# EAGLE design logger_Chad (EAGLE 6.5.0)
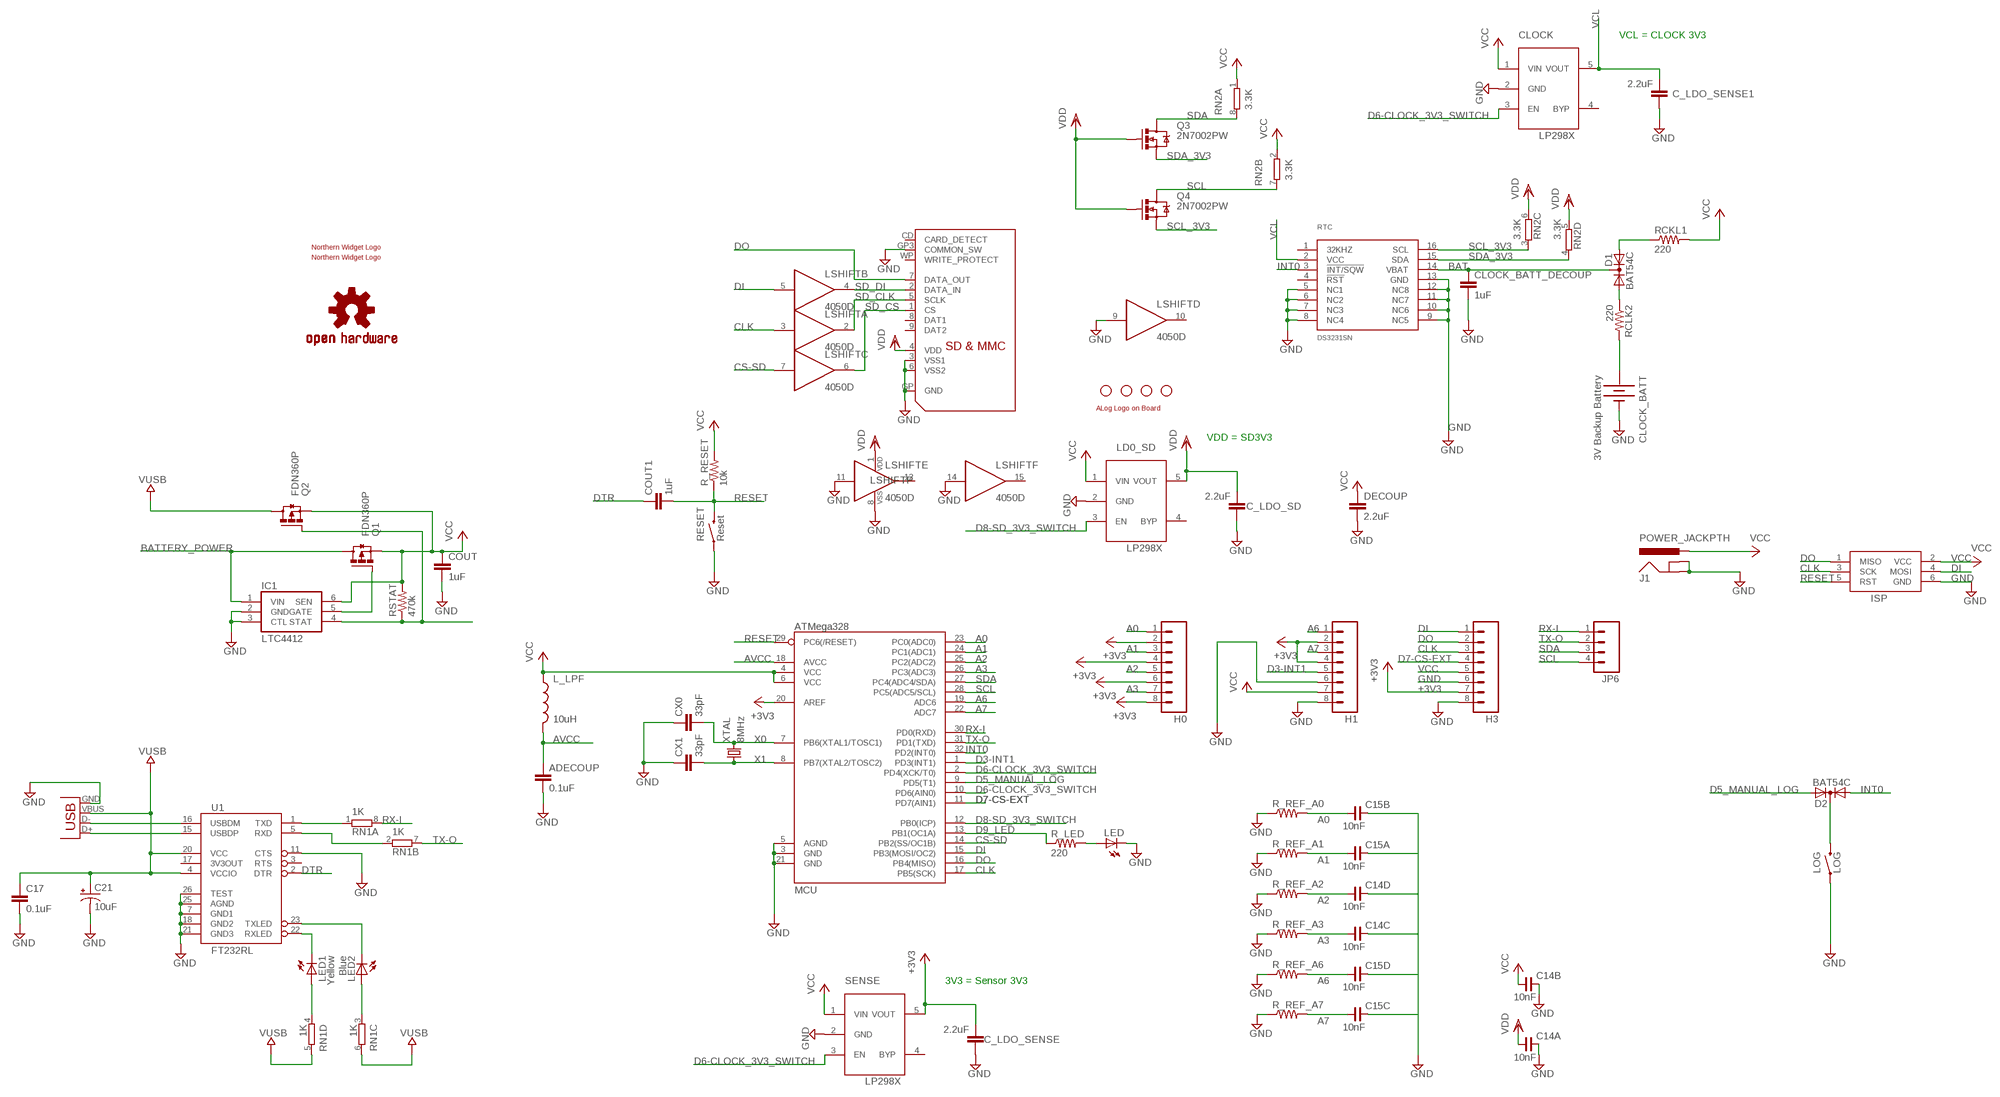
[diagram p0: schematic, sheet 1]

## Parts
ADECOUP  0.1uF  C-EUC0603  [C0603]
C14  10nF  CCA_ECJ-1206  [CECJ-1206]
C15  10nF  CCA_ECJ-1206  [CECJ-1206]
C17  0.1uF  C-EUC0603  [C0603]
C21  10uF  CAP_POL1206  [EIA3216]
C_LDO_SD  2.2uF  C-EUC0603  [C0603]
C_LDO_SENSE  2.2uF  C-EUC0603  [C0603]
C_LDO_SENSE1  2.2uF  C-EUC0603  [C0603]
CLOCK  LP2985  LP298XS  [SOT23-5L]
CLOCK_BATT  3V Backup Battery  BATTERY12PTH  [BATTCON_12MM_PTH]
CLOCK_BATT_DECOUP  1uF  C-EUC0603  [C0603]
COUT  1uF  C-EUC0603  [C0603]
COUT1  1uF  C-EUC0603  [C0603]
CX0  33pF  C-EUC0603  [C0603]
CX1  33pF  C-EUC0603  [C0603]
D1  BAT54C  DIODE_AC-CA_  [SOT23C]
D2  BAT54C  DIODE_AC-CA_  [SOT23C]
DECOUP  2.2uF  C-EUC0603  [C0603]
H0  M083.5MM-8  [SCREWTERMINAL-3.5MM-8]
H1  M083.5MM-8  [SCREWTERMINAL-3.5MM-8]
H3  M083.5MM-8  [SCREWTERMINAL-3.5MM-8]
IC1  LTC4412  LTC4412ES6  [TSOT23-6]
ISP  AVRISP-6  [AVRISP]
J1  POWER_JACKPTH  [POWER_JACK_PTH]
JP1  STAND-OFF  [STAND-OFF]
JP2  STAND-OFF  [STAND-OFF]
JP3  STAND-OFF  [STAND-OFF]
JP4  STAND-OFF  [STAND-OFF]
JP5  USB-B  USBPTH  [USB-B-PTH]
JP6  M04SCREW  [SCREWTERMINAL-3.5MM-4]
L_LPF  10uH  INDUCTOR0805  [0805]
LD0_SD  LP2985  LP298XS  [SOT23-5L]
LED  LED3MM  [LED3MM]
LED1  Yellow  LED0603  [LED-0603]
LED2  Blue  LED0603  [LED-0603]
LOG  LOG  SWITCH-MOMENTARY-2PTH  [TACTILE-PTH]
LOGO1  OSHW-LOGOM  [OSHW-LOGO-M]
LSHIFT  4050D  [SO16]
MCU  ATMega328  ATMEGA168  [TQFP32-08]
Q1  FDN360P  [SUPER-SOT3]
Q2  FDN360P  [SUPER-SOT3]
Q3  2N7002PW  MOSFET-NCHANNELSOT323  [SOT323]
Q4  2N7002PW  MOSFET-NCHANNELSOT323  [SOT323]
R_LED  220  R-US_R0603  [R0603]
R_REF_A0  R-US_0207/10  [0207/10]
R_REF_A1  R-US_0207/10  [0207/10]
R_REF_A2  R-US_0207/10  [0207/10]
R_REF_A3  R-US_0207/10  [0207/10]
R_REF_A6  R-US_0207/10  [0207/10]
R_REF_A7  R-US_0207/10  [0207/10]
R_RESET  10k  R-US_R0603  [R0603]
RCKL1  220  R-US_R0603  [R0603]
RCLK2  220  R-US_R0603  [R0603]
RESET  Reset  SWITCH-MOMENTARY-2PTH  [TACTILE-PTH]
RN1  1K  4R-N0603-ARC  [0603-ARC]
RN2  3.3K  4R-N0603-ARC  [0603-ARC]
RSTAT  470k  R-US_R0603  [R0603]
RTC  DS3231SN  [SO16W]
SD  SDMMC06132  [06132]
SENSE  LP2985  LP298XS  [SOT23-5L]
U1  FT232RL  FT232RL-BASICSSOP  [SSOP28DB]
U$1  NWLOGO  [NWLOGO]
U$2  ALOG_LOGO_V1_5.5MM  [ALOG_LOGO_V1_SMALL]
U$3  NWLOGO_MED  [NWLOGO_MED]
XTAL  8MHz  CRYSTALHC49UV  [HC49U-V]

## Nets
+3V3: C_LDO_SENSE.2 H0.2 H0.4 H0.6 H0.8 H1.2 H1.4 H3.7 MCU.20(AREF) SENSE.5(VOUT)
A0: C15.B1 H0.1 MCU.23(PC0(ADC0)) R_REF_A0.2
A1: C15.A1 H0.3 MCU.24(PC1(ADC1)) R_REF_A1.2
A2: C14.D1 H0.5 MCU.25(PC2(ADC2)) R_REF_A2.2
A3: C14.C1 H0.7 MCU.26(PC3(ADC3)) R_REF_A3.2
A6: C15.D1 H1.1 MCU.19(ADC6) R_REF_A6.2
A7: C15.C1 H1.3 MCU.22(ADC7) R_REF_A7.2
AVCC: ADECOUP.1 L_LPF.2 MCU.18(AVCC)
BAT: CLOCK_BATT_DECOUP.1 D1.3(K) RTC.14(VBAT)
BATTERY_POWER: IC1.1(VIN) Q1.3(D)
CLK: H3.3 ISP.3(SCK) LSHIFT.3(A:I) MCU.17(PB5(SCK))
CS-SD: LSHIFT.7(C:I) MCU.14(PB2(SS/OC1B))
D3-INT1: H1.5 MCU.1(PD3(INT1))
D5_MANUAL_LOG: D2.2(A2) MCU.9(PD5(T1))
D6-CLOCK_3V3_SWITCH: CLOCK.3(EN) MCU.2(PD4(XCK/T0)) MCU.10(PD6(AIN0)) SENSE.3(EN)
D7-CS-EXT: H3.4 MCU.11(PD7(AIN1))
D8-SD_3V3_SWITCH: LD0_SD.3(EN) MCU.12(PB0(ICP))
D9_LED: MCU.13(PB1(OC1A)) R_LED.1
DI: H3.1 ISP.4(MOSI) LSHIFT.5(B:I) MCU.15(PB3(MOSI/OC2))
DO: H3.2 ISP.1(MISO) MCU.16(PB4(MISO)) SD.7(DATA_OUT)
DTR: COUT1.1 U1.2(DTR)
GND: ADECOUP.2 C14.A2 C14.B2 C14.C2 C14.D2 C15.A2 C15.B2 C15.C2 C15.D2 C17.2 C21.C(-) C_LDO_SD.1 C_LDO_SENSE1.1 C_LDO_SENSE.1 CLOCK.2(GND) CLOCK_BATT.GND(-) CLOCK_BATT_DECOUP.2 COUT.2 CX0.1 CX1.1 DECOUP.2 H1.6 H1.8 H3.6 H3.8 IC1.2(GND) IC1.3(CTL) ISP.6(GND) J1.GND J1.GNDBREAK JP5.GND LD0_SD.2(GND) LED.K(C) LOG.1 LSHIFT.8(P:VSS) LSHIFT.9(D:I) LSHIFT.11(E:I) LSHIFT.14(F:I) MCU.3(GND) MCU.5(AGND) MCU.21(GND) R_REF_A0.1 R_REF_A1.1 R_REF_A2.1 R_REF_A3.1 R_REF_A6.1 R_REF_A7.1 RESET.1 RTC.5(NC1) RTC.6(NC2) RTC.7(NC3) RTC.8(NC4) RTC.9(NC5) RTC.10(NC6) RTC.11(NC7) RTC.12(NC8) RTC.13(GND) SD.3(VSS1) SD.6(VSS2) SD.GP3(COMMON_SW) SD.GP(GND) SENSE.2(GND) U1.7(GND1) U1.11(CTS) U1.18(GND2) U1.21(GND3) U1.25(AGND) U1.26(TEST)
INT0: D2.1(A1) MCU.32(PD2(INT0)) RTC.3(!INT/SQW)
LED+: LED.A R_LED.2
N$1: D1.1(A1) RCLK2.1
N$2: CLOCK_BATT.VCC@1(+) RCLK2.2
N$3: JP5.D+ U1.15(USBDP)
N$4: JP5.D- U1.16(USBDM)
N$5: LED1.C U1.22(RXLED)
N$6: LED2.C U1.23(TXLED)
N$7: IC1.4(STAT) Q2.1(G) RSTAT.1
N$8: IC1.5(GATE) Q1.1(G)
N$9: LED1.A RN1.4
N$10: LED2.A RN1.3
N$11: D2.3(K) LOG.3
N$27: RN1.1 U1.1(TXD)
N$29: RN1.2 U1.5(RXD)
N$67: D1.2(A2) RCKL1.1
RESET: COUT1.2 ISP.5(RST) MCU.29(PC6(/RESET)) R_RESET.1 RESET.3
RX-I: JP6.1 MCU.30(PD0(RXD)) RN1.8
SCL: JP6.4 MCU.28(PC5(ADC5/SCL)) Q4.3(D) RN2.7
SCL_3V3: Q4.2(S) RN2.3 RTC.16(SCL)
SD_CLK: LSHIFT.2(A:O) SD.5(SCLK)
SD_CS: LSHIFT.6(C:O) SD.1(CS)
SD_DI: LSHIFT.4(B:O) SD.2(DATA_IN)
SDA: JP6.3 MCU.27(PC4(ADC4/SDA)) Q3.3(D) RN2.8
SDA_3V3: Q3.2(S) RN2.4 RTC.15(SDA)
TX-O: JP6.2 MCU.31(PD1(TXD)) RN1.7
VCC: C14.B1 CLOCK.1(VIN) COUT.1 DECOUP.1 H1.7 H3.5 IC1.6(SEN) ISP.2(VCC) J1.PWR L_LPF.1 LD0_SD.1(VIN) MCU.4(VCC) MCU.6(VCC) Q1.2(S) Q2.2(S) R_RESET.2 RCKL1.2 RN2.1 RN2.2 RSTAT.2 SENSE.1(VIN)
VCL: C_LDO_SENSE1.2 CLOCK.5(VOUT) RTC.2(VCC)
VDD: C14.A1 C_LDO_SD.2 LD0_SD.5(VOUT) LSHIFT.1(P:VDD) Q3.1(G) Q4.1(G) RN2.5 RN2.6 SD.4(VDD)
VUSB: C17.1 C21.A(+) JP5.VBUS Q2.3(D) RN1.5 RN1.6 U1.4(VCCIO) U1.20(VCC)
X0: CX0.2 MCU.7(PB6(XTAL1/TOSC1)) XTAL.2
X1: CX1.2 MCU.8(PB7(XTAL2/TOSC2)) XTAL.1
Unconnected: CLOCK.4(BYP) LD0_SD.4(BYP) LSHIFT.10(D:O) LSHIFT.12(E:O) LSHIFT.15(F:O) RTC.1(32KHZ) RTC.4(!RST) SD.8(DAT1) SD.9(DAT2) SD.CD(CARD_DETECT) SD.WP(WRITE_PROTECT) SENSE.4(BYP) U1.3(RTS) U1.17(3V3OUT)

## Notes on the sheet
- VCL = CLOCK 3V3
- VDD = SD3V3
- 3V3 = Sensor 3V3

## Library data of the parts
ADECOUP C17 C_LDO_SD C_LDO_SENSE C_LDO_SENSE1 CX0 CX1 DECOUP = resistor:C-EU: CAPACITOR, European symbol
C14 C15 = rc-master-smd:CCA_: CHIP CAP ARRAY
C21 = SparkFun-Passives:CAP_POL: Capacitor Polarized These are standard SMD and PTH capacitors. Normally 10uF, 47uF, and 100uF in electrolytic and tantalum varieties. Always verify the external diameter of the through hole cap, it varies with capacity, voltage, and manufacturer. The EIA devices should be standard.
CLOCK LD0_SD SENSE = adafruit:LP298X
CLOCK_BATT = SparkFun:BATTERY: Battery Holders Various common sizes : AA, AAA, 20mm coin cell and 12mm coin cell.
CLOCK_BATT_DECOUP COUT COUT1 = rcl:C-EU: CAPACITOR, European symbol
D1 D2 = semicon-smd-ipc:DIODE_AC-CA_: DUAL DIODE
H0 H1 H3 = SparkFun:M08: Header 8 Standard 8-pin 0.1" header. Use with straight break away headers (SKU : PRT-00116), right angle break away headers (PRT-00553), swiss pins (PRT-00743), machine pins (PRT-00117), and female headers (PRT-00115).
IC1 = awickert:LTC4412*: Low Loss PowerPath Controller
ISP = adafruit:AVRISP: AVR ISP HEADER Standard 6 pin header for AVR programming
J1 = SparkFun:POWER_JACK: Power Jack This is the standard 5.5mm barrel jack for power. The PTH is the most common, proven, reliable, footprint. All others are experimental. The Slot footprint only works if the mill layer is transmitted to the PCB fab house so be warned. Spark Fun Electronics SKU : PRT-00119. Mating wall wart : TOL-00298 (and others)
JP1-JP4 = SparkFun:STAND-OFF: Stand Off This is the mechanical footprint for a #4 phillips button head screw. Use the keepout ring to avoid running the screw head into surrounding components. SKU : PRT-00447
JP5 = SparkFun-Connectors:USB: USB Connectors USB-B-PTH is fully proven SKU : PRT-00139/CONN-08278 USB-miniB is fully proven SKU : PRT-00587 USB-A-PCB is untested. USB-A-H is throughly reviewed, but untested. Spark Fun Electronics SKU : PRT-00437 USB-B-SMT is throughly reviewed, but untested. Needs silkscreen touching up. USB-A-S has not been used/tested USB-MB-H has not been used/tested USB-MICROB has been used. CONN-09505; PROD_ID: CONN-08278
JP6 = SparkFun-Connectors:M04: Header 4 Standard 4-pin 0.1" header. Use with straight break away headers (SKU : PRT-00116), right angle break away headers (PRT-00553), swiss pins (PRT-00743), machine pins (PRT-00117), and female headers (PRT-00115). Molex polarized connector foot print use with SKU : PRT-08231 with associated crimp pins and housings. 1MM SMD Version SKU: PRT-10208; PROD_ID: Combine 2x8399
L_LPF = SparkFun:INDUCTOR: Inductors Basic Inductor/Choke - 0603 and 1206. Footprints are not proven and vary greatly between part numbers.
LED = SparkFun:LED: LEDs Standard schematic elements and footprints for 5mm, 3mm, 1206, and 0603 sized LEDs. 5mm - Spark Fun Electronics SKU : COM-00529 (and others)
LED1 LED2 = SparkFun-LED:LED: LEDs Standard schematic elements and footprints for 5mm, 3mm, 1206, and 0603 sized LEDs. 5mm - Spark Fun Electronics SKU : COM-00529 (and others)
LOG RESET = SparkFun-Electromechanical:SWITCH-MOMENTARY-2: Various NO switches- pushbuttons, reed, etc; PROD_ID: SWCH-08441
LOGO1 = SparkFun-Aesthetics:OSHW-LOGO: Open Source Hardware Logo This logo indicates the piece of hardware it is found on incorporates a OSHW license and/or adheres to the definition of open source hardware found here: http://freedomdefined.org/OSHW
LSHIFT = 40xx:4050: Hex non-inverting BUFFER
MCU = SparkFun:ATMEGA168
Q1 Q2 = transistor-power:FDN360P: Single P-Channel, PowerTrench (R) MOSFET Source: http://www.fairchildsemi.com/ds/FD/FDN360P.pdf
Q3 Q4 = SparkFun-DiscreteSemi:MOSFET-NCHANNEL: Generic NMOS footprint
R_LED R_REF_A0 R_REF_A1-R_REF_A3 R_REF_A6 R_REF_A7 = resistor:R-US_: RESISTOR, American symbol
R_RESET RCKL1 RCLK2 RSTAT = rcl:R-US_: RESISTOR, American symbol
RN1 RN2 = resistor-dil:4R-N: Array Chip Resistor Source: RS Component / Phycomp; OC_FARNELL: unknown; OC_NEWARK: unknown
RTC = comfile:DS3231SN
SD = adafruit:SDMMC: SD MMC Card holder 4UCON part #06132 - easy to solder
U1 = SparkFun-DigitalIC:FT232RL-BASIC: USB UART This is the simplified version of the FT232RL unit. Only what you need, nothing you don't. Spark Fun Electronics SKU : COM-00650
U$1 = awickert:NWLOGO
U$2 = awickert:ALOG_LOGO_V1_5.5MM
U$3 = awickert:NWLOGO_MED: Medium-sized Northern Widget logo
XTAL = SparkFun:CRYSTAL: Crystals Various standard crystals. Proven footprints. Spark Fun Electronics SKU : COM-00534

## Net classes
0 default: width 0.203 mm, drill 0.305 mm
1 power: width 0.305 mm, drill 0.508 mm
2 gnd: width 0.61 mm, drill 0.508 mm, clearance 0.203 mm
3 usbvcc: width 0.508 mm, drill 0.508 mm, clearance 0.152 mm
4 aref: width 0.406 mm

## Board
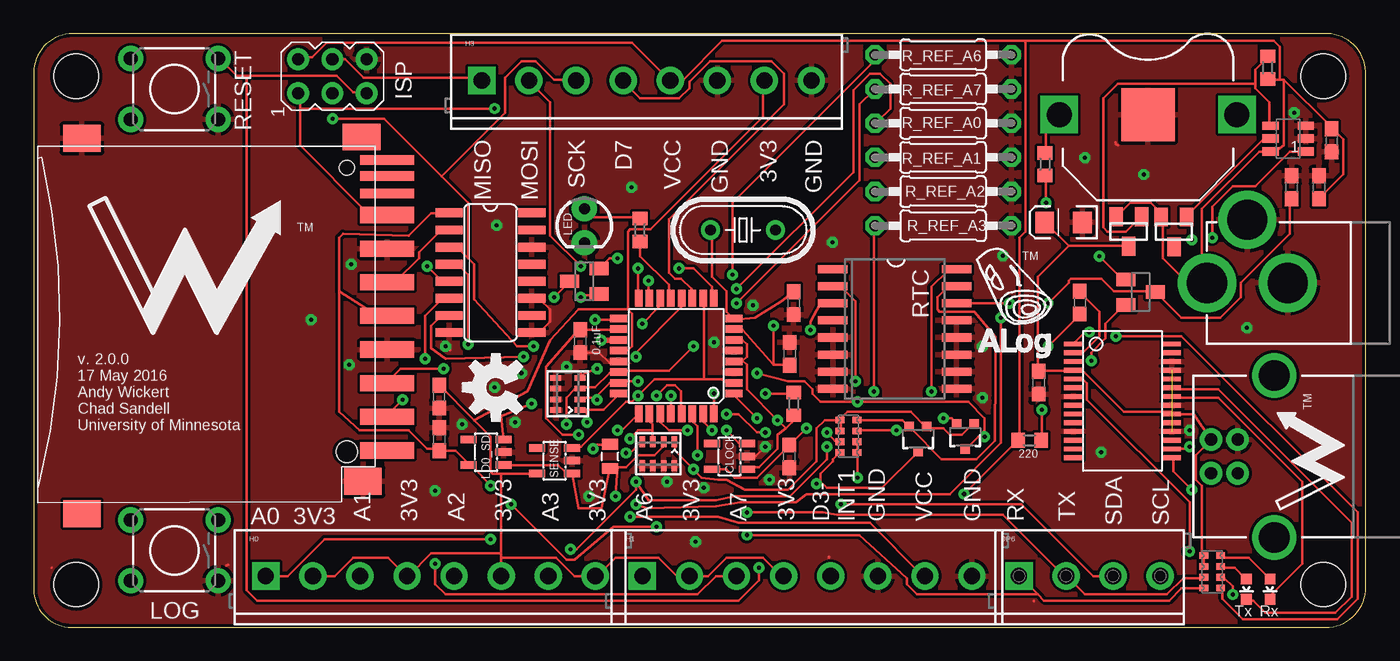
[diagram p1: board, top side]
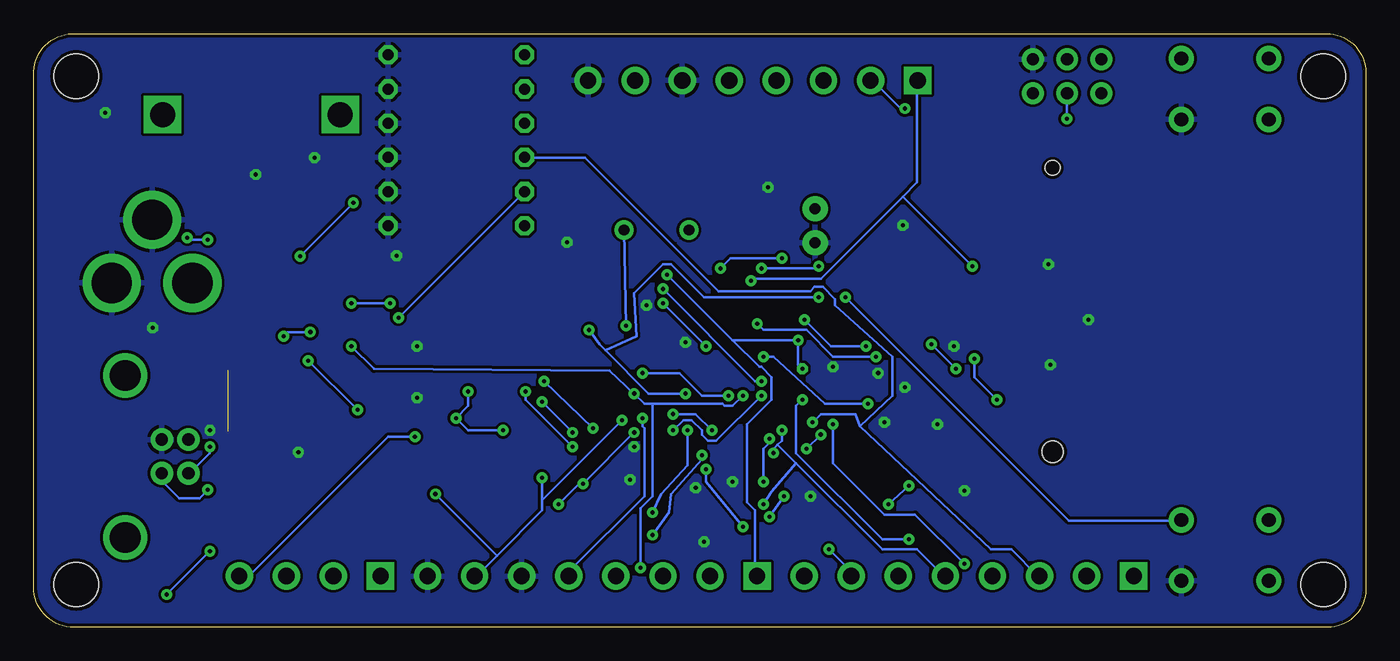
[diagram p2: board, bottom side, seen from below]

Size 99.05 x 44.12 mm. Coordinates in mm from the lower left corner, seen from the top.
Outline: 99.05,41.32 arc90 95.93,44.12 2.91,44.12 arc90 0,41.21 0,2.85 arc90 2.85,0 96.06,0 arc90 99.05,2.98 99.05,41.32
Copper layers (1*16): Top 0.035mm / dielectric 1.5mm / Bottom 0.035mm
Design rules "SparkFun *": minimum track width 8mil, minimum drill 12mil, track to track 8mil, track to pad 8mil, pad to pad 8mil, via to via 8mil, smd to smd 8mil, copper to edge 10mil, drill to drill 8mil, minimum pad ring 12mil, minimum via ring 10mil, stop-mask expansion 4mil, vias tented up to drill 25mil, thermal gap 10mil

### Footprints (pad centres in the part's own frame; a part is rotated, then mirrored left to right if it is on the bottom)
C0603 = smd 1.1 x 1: 1 -0.85,0; 2 0.85,0
CECJ-1206 = smd 0.406 x 0.813: A1 -1.2,-0.9; A2 -1.2,0.9; B1 -0.4,-0.9; B2 -0.4,0.9; C1 0.4,-0.9; C2 0.4,0.9; D1 1.2,-0.9; D2 1.2,0.9
EIA3216 = smd 1.4 x 1.6: A 1.4,0; C -1.4,0
SOT23-5L = smd 0.55 x 1.2: 1 -0.95,-1.3; 2 0,-1.3; 3 0.95,-1.3; 4 0.95,1.3; 5 -0.95,1.3
BATTCON_12MM_PTH = smd 3.962 x 3.962: GND 0,0 | drill 1.854 square: VCC@1 -6.604,0; VCC@2 6.604,0
SOT23C = smd 1 x 1.4: 1 -0.95,-1.1; 2 0.95,-1.1; 3 0,1.1
SCREWTERMINAL-3.5MM-8 = drill 1.2 pad 2.032 square: 1 0,0 | drill 1.2 pad 2.032: 2 3.5,0; 3 7,0; 4 10.5,0; 5 14,0; 6 17.5,0; 7 21,0; 8 24.5,0
TSOT23-6 = smd 0.622 x 1.22: 1 -0.95,-1.31; 2 0,-1.31; 3 0.95,-1.31; 4 0.95,1.31; 5 0,1.31; 6 -0.95,1.31
AVRISP = drill 0.9 pad 1.626: 1 -1.27,2.54; 2 1.27,2.54; 3 -1.27,0; 4 1.27,0; 5 -1.27,-2.54; 6 1.27,-2.54
POWER_JACK_PTH = drill 2.997 pad 4.318: GND 0,7.7; GNDBREAK 4.7,10.7; PWR 0,13.7
STAND-OFF = hole 3.302: 0,0
USB-B-PTH = drill 0.914 pad 1.676: D+ 0,1.25; D- 1.981,1.25; GND 0,-1.25; VBUS 1.981,-1.25 | drill 2.286: S1 -2.718,-6.02; S2 -2.718,6.02
SCREWTERMINAL-3.5MM-4 = drill 1.2 pad 2.032 square: 1 0,0 | drill 1.2 pad 2.032: 2 3.5,0; 3 7,0; 4 10.5,0
0805 = smd 0.8 x 1.2: 1 -0.9,0; 2 0.9,0
LED3MM = drill 0.813 pad 1.88: A -1.27,0; K 1.27,0
LED-0603 = smd 0.8 x 0.8: A 0,-0.75; C 0,0.75
TACTILE-PTH = drill 1.016 pad 1.88: 1 -3.251,2.261; 2 3.251,2.261; 3 -3.251,-2.261; 4 3.251,-2.261
SO16 = smd 0.66 x 2.032: 1 -4.445,-3.073; 2 -3.175,-3.073; 3 -1.905,-3.073; 4 -0.635,-3.073; 5 0.635,-3.073; 6 1.905,-3.073; 7 3.175,-3.073; 8 4.445,-3.073; 9 4.445,3.073; 10 3.175,3.073; 11 1.905,3.073; 12 0.635,3.073; 13 -0.635,3.073; 14 -1.905,3.073; 15 -3.175,3.073; 16 -4.445,3.073
TQFP32-08 = smd 1.27 x 0.559: 1 -4.293,2.8; 2 -4.293,2; 3 -4.293,1.2; 4 -4.293,0.4; 5 -4.293,-0.4; 6 -4.293,-1.2; 7 -4.293,-2; 8 -4.293,-2.8; 17 4.293,-2.8; 18 4.293,-2; 19 4.293,-1.2; 20 4.293,-0.4; 21 4.293,0.4; 22 4.293,1.2; 23 4.293,2; 24 4.293,2.8 | smd 0.559 x 1.27: 9 -2.8,-4.293; 10 -2,-4.293; 11 -1.2,-4.293; 12 -0.4,-4.293; 13 0.4,-4.293; 14 1.2,-4.293; 15 2,-4.293; 16 2.8,-4.293; 25 2.8,4.293; 26 2,4.293; 27 1.2,4.293; 28 0.4,4.293; 29 -0.4,4.293; 30 -1.2,4.293; 31 -2,4.293; 32 -2.8,4.293
SUPER-SOT3 = smd 1 x 1.4: 1 -0.95,-1.1; 2 0.95,-1.1; 3 0,1.1
SOT323 = smd 0.7 x 0.7: 1 -0.65,-0.925; 2 0.65,-0.925; 3 0,0.925
R0603 = smd 1 x 1.1: 1 -0.85,0; 2 0.85,0
0207/10 = drill 0.813 octagon: 1 -5.08,0; 2 5.08,0
0603-ARC = smd 0.5 x 0.65: 1 -1.2,-0.625; 2 -0.4,-0.625; 3 0.4,-0.625; 4 1.2,-0.625; 5 1.2,0.625; 6 0.4,0.625; 7 -0.4,0.625; 8 -1.2,0.625
SO16W = smd 0.6 x 2.2: 1 -4.445,-4.6; 2 -3.175,-4.6; 3 -1.905,-4.6; 4 -0.635,-4.6; 5 0.635,-4.6; 6 1.905,-4.6; 7 3.175,-4.6; 8 4.445,-4.6; 9 4.445,4.6; 10 3.175,4.6; 11 1.905,4.6; 12 0.635,4.6; 13 -0.635,4.6; 14 -1.905,4.6; 15 -3.175,4.6; 16 -4.445,4.6
06132 = smd 1.2 x 4: 1 6.9,0.9; 2 4.4,0.9; 3 1.9,0.9; 4 -0.6,0.9; 5 -3.1,0.9; 6 -5.6,0.9; 7 -8.1,0.9; 9 9.4,0.9 | smd 0.7 x 4: 8 -9.7,0.9; CD -11,0.9; WP -12.2,0.9 | smd 2 x 2.8: GP -13.8,-21.8; GP2 14.1,-21.8; GP3 11.7,-0.9; GP4 -13.9,-1 | hole 1.1: -11.6,-2.1 | hole 1.6: 9.5,-2.1
SSOP28DB = smd 0.348 x 1.397: 1 -4.225,-3.656; 2 -3.575,-3.656; 3 -2.925,-3.656; 4 -2.275,-3.656; 5 -1.625,-3.656; 6 -0.975,-3.656; 7 -0.325,-3.656; 8 0.325,-3.656; 9 0.975,-3.656; 10 1.625,-3.656; 11 2.275,-3.656; 12 2.925,-3.656; 13 3.575,-3.656; 14 4.225,-3.656; 15 4.225,3.656; 16 3.575,3.656; 17 2.925,3.656; 18 2.275,3.656; 19 1.625,3.656; 20 0.975,3.656; 21 0.325,3.656; 22 -0.325,3.656; 23 -0.975,3.656; 24 -1.625,3.656; 25 -2.275,3.656; 26 -2.925,3.656; 27 -3.575,3.656; 28 -4.225,3.656
HC49U-V = drill 0.813: 1 -2.413,0; 2 2.413,0

### Placement (x,y rotation side)
ADECOUP  40.63,21.27 270 top
C14  46.45,12.9 180 top
C15  39.71,17.35 90 top
C17  74.72,18.19 270 top
C21  76.56,30.1 180 top
C_LDO_SD  30.15,13.97 270 top
C_LDO_SENSE  30.15,17.14 90 top
C_LDO_SENSE1  56.19,12.7 90 top
CLOCK  51.74,12.7 90 top
CLOCK_BATT  82.86,38.1 0 top
CLOCK_BATT_DECOUP  93.53,32.7 90 top
COUT  95.56,32.7 90 top
COUT1  77.78,24.13 270 top
CX0  56.2,20.32 270 top
CX1  56.51,24.09 90 top
D1  82.3,24.91 270 top
D2  40.95,25.72 90 top
DECOUP  96.51,36.2 270 top
H0  17.26,3.81 0 top
H1  45.26,3.81 0 top
H3  33.33,40.64 0 top
IC1  93.27,36.33 90 top
ISP  22.21,40.96 90 top
J1  100.94,25.59 90 top
JP1  3.17,3.17 0 top
JP2  95.88,40.96 90 top
JP3  95.88,3.17 90 top
JP4  3.17,40.96 0 top
JP5  89.52,12.7 180 top
JP6  73.26,3.81 0 top
L_LPF  42.85,12.7 90 top
LD0_SD  33.65,13.02 90 top
LED  40.95,29.84 270 top
LED1  91.92,2.83 180 top
LED2  90.17,2.83 180 top
LOG  10.47,5.71 180 top
LOGO1  34.37,17.83 90 top
LSHIFT  33.96,26.35 270 top
MCU  47.78,20.17 180 top
Q1  84.77,29.39 180 top
Q2  81.41,29.42 180 top
Q3  65.76,14.01 180 top
Q4  69.27,14.17 180 top
R_LED  45.08,29.53 90 top
R_REF_A0  67.62,37.47 180 top
R_REF_A1  67.62,34.92 180 top
R_REF_A2  67.62,32.38 180 top
R_REF_A3  67.62,29.84 180 top
R_REF_A6  67.62,42.55 180 top
R_REF_A7  67.62,40.01 180 top
R_RESET  56.51,16.61 270 top
RCKL1  74.04,13.89 180 top
RCLK2  75.19,34.42 90 top
RESET  10.47,40.01 180 top
RN1  87.62,4.13 90 top
RN2  60.58,14.2 90 top
RSTAT  91.75,41.59 270 top
RTC  64.02,22.17 270 top
SD  25.39,22.54 270 top
SENSE  38.73,12.38 90 top
U1  80.95,16.83 270 top
U$1  11.2,26.47 0 top
U$2  72.98,25.26 0 top
U$3  94.48,12.32 90 top
XTAL  52.75,29.53 0 top

### Tracks (layer width: path | path; a pad name or v marks a point on that pad's centre or on a via)
+3V3
  Top 0.203: H1.4 55.62,3.81 54.24,5.18 51.5,5.18 50.13,3.81 H1.2 47.84,3.81 46.47,5.18 43.27,5.18 41.9,3.81 H0.8 40.22,3.81 38.85,5.18 34.74,5.18 | H0.2 22.39,3.81 23.76,5.18 26.35,5.18 27.73,3.81 H0.4 27.88,3.81 29.56,5.49 34.74,5.49 | 32.76,15.39 33.98,14.17 33.98,11.58 34.13,11.43 34.74,11.43 | 32.76,15.39 30.16,17.98 C_LDO_SENSE.2 | 34.74,11.43 37.33,11.43 SENSE.5 | 44.19,23.62 44.49,23.32 44.49,20.88 44.19,20.57 43.58,20.57 MCU.20 | 44.19,23.62 40.53,23.62 38.4,21.34 36.72,17.53 32.76,15.39 | 34.74,11.43 34.74,5.49 | 34.74,5.49 34.74,5.18 | 34.74,5.18 34.74,3.81 H0.6 | 44.19,23.62 44.19,29.41 44.34,29.57 45.86,29.57 54.24,37.95 54.24,40.54 H3.7
A0  (via drill 0.3)
  Top 0.203: 41.75,17.07 40.68,17.07 C15.B1 | 41.75,17.07 42.81,18.14 43.42,18.14 MCU.23 43.58,18.29 v44.95,18.29 | v52.26,25.15 60.95,33.83 60.95,39.93 62.17,41.15 62.93,41.15 63.69,40.39 63.69,38.56 62.63,37.49 R_REF_A0.2 | H0.1 18.89,3.81 21.63,6.55 v33.98,6.55 | 41.75,17.07 v41.9,16.92
  Bottom 0.203: v44.95,18.29 45.41,18.29 v52.26,25.15 | v33.98,6.55 35.96,6.55 42.36,12.95 42.36,16.46 v41.9,16.92
A1  (via drill 0.3)
  Top 0.203: 41.14,16.15 42.36,16.15 43.42,17.22 MCU.24 | 41.14,16.15 40.68,16.15 C15.A1 | v41.14,15.24 41.14,16.15
  Bottom 0.203: v41.14,15.24 40.53,15.85 37.94,15.85 37.63,14.94 | 37.63,14.94 27.88,5.79 26.35,5.79 24.37,3.81 H0.3 | 37.63,14.94 35.19,17.22 35.19,20.12 39.46,23.93 39.46,24.38 40.38,25.3 40.99,25.3 41.29,24.99 48.15,24.99 58.05,34.9 62.47,34.9 R_REF_A1.2
A2  (via drill 0.3)
  Top 0.203: v44.03,12.95 44.34,12.95 45.1,13.72 C14.D1 | v43.42,14.63 43.73,14.63 44.95,15.85 MCU.25 | v71.92,23.01 71.92,13.72 68.11,9.91 57.45,9.91 56.68,9.3 52.57,9.3 50.74,8.99 45.56,8.84 v44.8,9.14
  Bottom 0.203: v44.03,12.95 44.03,13.26 43.73,13.56 | 43.73,13.56 43.42,13.87 v43.42,14.63 | 42.36,12.19 35.96,5.79 33.37,5.79 31.38,3.81 H0.5 | 42.36,12.19 43.73,13.56 | v71.92,23.01 62.63,32.31 R_REF_A2.2 | v44.8,9.14 44.19,10.06 42.36,12.19
A3  (via drill 0.3)
  Top 0.203: 46.02,14.63 46.02,15.09 45.86,15.24 45.86,15.85 MCU.26 | 46.02,14.63 46.02,13.87 C14.C1 | 46.02,14.63 44.95,14.63 v44.34,14.02 | v39.92,5.79 40.38,5.79 44.8,10.21 v44.8,10.82 45.71,9.45 50.74,9.45 52.11,9.75 56.23,9.75 58.97,12.5 v58.97,13.41 | v62.47,17.53 62.47,29.72 R_REF_A3.2
  Bottom 0.203: v44.34,14.02 44.34,13.72 44.8,13.26 v44.8,10.82 | v39.92,5.79 38.4,4.27 38.4,3.81 H0.7 | v62.47,17.53 62.47,16.92 v58.97,13.41
A6  (via drill 0.3)
  Top 0.203: 40.68,18.9 40.68,18.59 C15.D1 40.97,18.9 v41.9,19.2 | 42.81,21.34 43.42,21.34 MCU.19 | v51.96,26.21 51.96,31.55 62.47,42.06 62.47,42.52 R_REF_A6.2
  Top 0.406: v42.21,21.34 42.81,21.34
  Bottom 0.203: 47.08,21.34 v51.96,26.21 | 47.08,21.34 v42.21,21.34 42.21,19.51 v41.9,19.2 | 47.08,21.34 45.1,19.36 44.95,19.36 44.19,18.59 44.19,16.92 46.02,15.09 46.02,9.3 45.41,8.69 45.41,3.81 H1.1
A7  (via drill 0.3)
  Top 0.203: v49.06,20.88 47.23,19.05 43.58,19.05 MCU.22 43.42,18.9 42.81,18.9 41.75,17.83 40.68,17.83 C15.C1 40.53,17.68 40.22,17.68 39.61,17.07 v39.61,15.09 | v52.26,24.08 61.41,33.22 61.41,38.86 62.47,39.93 R_REF_A7.2 | H1.3 50.74,3.81 49.37,2.44 30.62,2.44 29.86,3.2 v29.86,4.72
  Bottom 0.203: v52.26,24.08 v49.06,20.88 | v29.86,4.72 33.52,8.38 35.8,8.38 39.61,12.19 v39.61,15.09
AVCC  (via drill 0.3)
  Top 0.203: MCU.18 43.42,22.1 40.68,22.1 ADECOUP.1 40.53,22.1 38.09,19.36 38.09,15.54 39.31,14.33 v40.53,14.33 | v41.59,13.26 41.9,13.56 42.81,13.56 L_LPF.2
  Bottom 0.203: v40.53,14.33 v41.59,13.26
BAT  (via drill 0.3)
  Top 0.203: CLOCK_BATT_DECOUP.1 93.41,31.85 93.41,29.26 89.75,25.6 89.75,24.54 88.23,23.01 85.33,23.01 83.5,24.84 D1.3 83.35,24.99 80.3,24.99 79.39,25.91 77.1,25.91 76.95,25.76 76.95,25.6 v75.43,24.08 | v72.53,24.08 RTC.14
  Bottom 0.203: v75.43,24.08 v72.53,24.08
BATTERY_POWER  (via drill 0.3)
  Top 0.203: v87.62,28.96 87.62,31.24 89.14,32.77 90.82,32.77 93.41,35.36 94.48,35.36 IC1.1 | v86.1,28.8 85.33,28.8 84.88,28.35 Q1.3
  Bottom 0.203: v87.62,28.96 87.47,28.8 v86.1,28.8
CLK  (via drill 0.3)
  Top 0.203: v41.75,22.86 43.42,22.86 MCU.17 | v37.18,20.88 35.96,20.88 32.76,24.38 32.76,26.98 32.3,27.43 | 32.3,27.43 31.54,28.19 30.93,28.19 LSHIFT.3 | v22.24,37.8 26.05,37.8 30.32,33.53 | 30.32,33.53 32.3,31.55 32.3,27.43 | 30.32,33.53 35.04,38.25 35.04,40.84 36.26,42.06 37.33,42.06 38.7,40.69 40.22,40.69 H3.3
  Bottom 0.203: v41.75,22.86 39.77,20.88 v37.18,20.88 | v22.24,37.8 22.24,39.62 ISP.3
CS-SD  (via drill 0.3)
  Top 0.203: v45.25,22.55 46.47,23.77 46.47,24.38 MCU.14 | v36.41,20.12 30.62,19.96 29.56,20.73 29.56,22.4 30.32,23.16 30.77,23.16 LSHIFT.7
  Bottom 0.203: v45.25,22.55 44.8,22.1 41.59,22.1 39.61,20.12 v36.41,20.12
D3-INT1  (via drill 0.3)
  Top 0.203: v53.79,15.54 52.11,17.22 MCU.1
  Bottom 0.203: v53.79,15.54 53.79,14.94 53.64,14.78 53.64,9.75 59.12,4.27 59.12,3.81 H1.5
D5_MANUAL_LOG  (via drill 0.3)
  Top 0.203: v48,26.67 49.06,26.67 50.43,25.3 50.43,24.54 MCU.9 | v43.42,27.43 42.81,27.43 D2.2
  Bottom 0.203: v48,26.67 47.23,27.43 v43.42,27.43
D6-CLOCK_3V3_SWITCH  (via drill 0.3)
  Top 0.203: 49.83,18.44 51.2,18.44 51.35,18.29 51.96,18.29 MCU.2 | 49.83,18.44 46.17,18.44 v44.95,17.22 44.49,16.76 44.03,16.76 40.68,13.41 40.07,13.41 SENSE.3 | v51.5,14.63 52.42,13.72 53.02,13.72 CLOCK.3 | 49.83,18.44 49.83,24.38 MCU.10
  Bottom 0.203: v51.5,14.63 50.74,15.39 50.13,15.39 49.37,14.63 49.37,14.33 48.91,13.87 48.3,13.87 v44.95,17.22
D7-CS-EXT
  Top 0.203: MCU.11 48.91,24.54 48.91,25.15 48.15,25.91 47.69,25.91 47.23,26.36 47.23,30.33 55.77,38.86 55.77,41.15 54.85,42.06 50.28,42.06 48.76,40.54 48.76,40.08 48,39.32 45.1,39.32 43.88,40.54 H3.4
D8-SD_3V3_SWITCH  (via drill 0.3)
  Top 0.203: v37.02,16.61 34.74,15.7 LD0_SD.3 | v44.8,20.12 44.8,20.42 48.15,23.77 48.15,24.38 MCU.12
  Bottom 0.203: v37.02,16.61 40.22,16.61 44.03,20.12 v44.8,20.12
D9_LED
  Top 0.203: R_LED.1 45.1,28.65 45.1,27.58 47.23,25.45 47.23,24.54 MCU.13
DI  (via drill 0.3)
  Top 0.203: v45.71,25.76 45.71,24.54 MCU.15 | v29.25,26.82 30.32,25.76 30.77,25.76 LSHIFT.5 | ISP.4 22.24,42.22 23.15,42.22 24.53,40.84 33.06,40.84 33.21,40.69 H3.1
  Bottom 0.203: v45.71,25.76 45.56,25.91 40.53,25.91 34.43,32 | 34.43,32 33.37,33.07 33.37,40.54 H3.1 | 34.43,32 v29.25,26.82
DO  (via drill 0.3)
  Top 0.203: 19.8,38.56 19.8,35.81 24.83,30.79 26.2,30.79 SD.7 | 19.8,38.56 19.8,39.62 ISP.1 | v44.95,26.67 44.95,24.54 MCU.16 | v40.68,26.82 38.4,29.11 38.4,39.01 36.87,40.54 H3.2 | v34.28,38.56 19.8,38.56
  Bottom 0.203: v44.95,26.67 40.83,26.67 v40.68,26.82 | v34.28,38.56 34.59,38.56 36.72,40.69 H3.2
DTR
  Top 0.203: COUT1.1 77.87,24.84 79.24,23.47 79.24,21.64 78.02,20.42 77.41,20.42 U1.2
GND  (via drill 0.3)  (2 unrouted)
  Top 0.203: LSHIFT.9 37.18,21.95 37.63,21.95 38.4,22.71 38.4,23.62 37.63,24.38 37.18,24.38 LSHIFT.11 | C15.B2 38.85,16.92 38.81,16.92 | C15.A2 39,16.31 38.81,16.31 | 30.93,20.57 30.98,20.63 | 12.64,2.74 12.52,2.72 | 14.32,4.57 14.45,4.65 | 1.36,4.42 | 59.12,5.18 59.12,5.23 | 14.47,37.64 14.47,37.69 | 74.36,1.98 74.36,1.93 | 13.77,4.27 13.86,4.27 LOG.1 | 80.46,35.97 80.42,36.06 | 80.61,35.81 80.45,35.94 | CLOCK.2 53.69,12.7 v54.4,13.41 | CLOCK.2 53.02,12.65 CLOCK.2 | CLOCK.2 53.18,12.8 CLOCK.2 | ADECOUP.2 42.05,20.42 42.81,19.66 43.42,19.66 MCU.21 | 30.32,20.88 v30.62,20.88 | 30.77,20.73 v30.62,20.88 | 30.77,20.57 v30.62,20.88 | 30.93,21.95 LSHIFT.8 30.93,21.95
  other vias: 20.63,22.86 59.4,28.61 49.2,6.35 44.44,32.7 72.06,27.62 82.54,33.66 79.36,13.02 70.55,20.88 90.21,22.25 78.17,34.9 35.8,15.24 29.83,10.16 31.84,15.09 34.43,29.87 23.46,19.51 23.61,26.97 50.59,21.18 53.48,23.93 70.55,17.07 85.94,14.63 34.28,17.83 36.26,18.9 39.61,19.35 41.29,9.75 47.08,10.82 49.82,10.36 54.7,10.97 93.72,38.25
  pour Bottom: -0.33,44.45 -0.33,-0.32 99.37,-0.32 99.37,44.45
  pour Top: -0.65,44.77 -0.65,-0.64 99.68,-0.64 99.68,44.77
INT0  (via drill 0.3)
  Top 0.203: v50.59,17.37 50.59,16 MCU.32 | v57.75,22.1 57.75,22.71 58.51,24.08 RTC.3 | v40.68,24.54 40.83,24.69 41.9,24.69 D2.1
  Bottom 0.203: v50.59,17.37 53.33,17.37 56.53,20.57 | 56.53,20.57 56.99,21.03 v57.75,22.1 | v40.68,24.54 49.22,24.54 51.65,26.98 52.26,26.98 54.4,24.84 54.24,21.64 56.53,20.57
LED+
  Top 0.203: R_LED.2 44.95,30.48 41.59,30.48 40.99,31.09 LED.A
N$1  (via drill 0.3)
  Top 0.203: v75.28,31.55 75.28,33.53 RCLK2.1 | v79.24,27.58 81.07,25.76 D1.1
  Bottom 0.203: v79.24,27.58 v75.28,31.55
N$2
  Top 0.203: RCLK2.2 75.28,35.36 75.28,37.19 76.19,38.1 CLOCK_BATT.VCC@1
N$3  (via drill 0.3)
  Top 0.203: v86.1,10.21 84.72,11.58 84.72,12.5 U1.15
  Bottom 0.203: v86.1,10.21 86.71,9.6 88.23,9.6 89.45,10.82 89.45,11.43 JP5.D+
N$4  (via drill 0.3)
  Top 0.203: v85.94,13.41 85.79,13.26 84.72,13.26 U1.16
  Bottom 0.203: v85.94,13.41 85.94,12.95 87.47,11.43 JP5.D-
N$5
  Top 0.203: LED1.C 92.04,2.13 92.04,2.44 94.33,4.72 94.33,10.82 88.08,17.07 84.72,17.07 U1.22
N$6
  Top 0.203: LED2.C 90.21,1.98 90.67,1.98 91.58,1.07 96.76,1.07 97.98,2.29 97.98,7.77 88.08,17.68 84.72,17.68 U1.23
N$7
  Top 0.203: 90.82,40.39 90.82,40.08 91.89,39.01 91.89,37.34 IC1.4 | 90.82,40.39 90.82,41.45 91.73,42.37 RSTAT.1 | 90.82,40.39 80.61,40.39 79.54,39.32 79.54,29.72 79.85,29.41 81.22,29.41 82.29,30.48 Q2.1
N$8
  Top 0.203: IC1.5 91.89,36.27 91.43,36.27 85.79,30.63 Q1.1
N$9
  Top 0.203: RN1.4 88.38,5.18 90.36,5.18 91.89,3.66 LED1.A
N$10
  Top 0.203: RN1.3 88.38,4.42 89.3,4.42 90.06,3.66 LED2.A
N$11  (via drill 0.3)
  Top 0.203: v38.7,24.54 39.77,25.6 D2.3
  Bottom 0.203: v38.7,24.54 22.09,7.92 13.86,7.92 LOG.3
N$27  (via drill 0.3)
  Top 0.203: v80.46,21.64 85.33,21.64 98.44,8.53 98.44,2.13 96.92,0.61 89.91,0.61 88.38,2.13 88.38,2.9 RN1.1 | v78.48,21.95 78.17,21.95 77.41,21.18 U1.1
  Bottom 0.203: v80.46,21.64 80.15,21.95 v78.48,21.95
N$29  (via drill 0.3)
  Top 0.203: v89.14,2.44 89.14,3.05 88.53,3.66 88.38,3.66 RN1.2 | v85.94,5.64 85.94,9.3 78.32,16.92 78.32,18.14 78.02,18.44 77.41,18.44 U1.5
  Bottom 0.203: v85.94,5.64 v89.14,2.44
N$67  (via drill 0.3)
  Top 0.203: v74.97,16.15 74.97,14.02 RCKL1.1 | v78.63,19.81 78.63,20.42 79.69,21.49 79.69,22.55 81.07,23.93 D1.2
  Bottom 0.203: v78.63,19.81 v74.97,16.15
RESET  (via drill 0.3)
  Top 0.203: 15.84,41 15.08,41 13.86,42.22 RESET.3 | 15.84,41 22.54,41 23.76,39.78 24.68,39.78 ISP.5 | v54.4,17.37 56.38,17.37 R_RESET.1 | v46.32,17.22 47.08,17.98 47.69,17.98 48.15,17.53 48.15,16 MCU.29 | v75.43,20.88 77.71,23.16 COUT1.2 | 15.84,41 15.84,2.74 16.6,1.98 52.42,1.98 53.94,3.5 v53.94,4.42
  Bottom 0.203: 53.02,16.61 47.84,16.61 47.69,16.46 47.08,16.46 v46.32,17.22 | 53.02,16.61 53.64,16.61 v54.4,17.37 56.23,19.05 73.75,19.2 v75.43,20.88 | v53.94,4.42 53.94,8.84 53.02,9.75 53.02,16.61
RX-I  (via drill 0.3)
  Top 0.203: 74.67,2.44 73.29,3.81 JP6.1 | 74.67,2.44 75.12,1.98 84.42,1.98 85.33,2.9 86.86,2.9 RN1.8 | v49.37,12.8 49.37,14.94 49.06,15.24 49.06,15.85 MCU.30 | v53.02,6.86 61.41,6.86 64.91,3.66 64.91,3.2 65.67,2.44 74.67,2.44
  Bottom 0.203: v49.37,12.8 49.37,12.5 51.65,9.91 51.81,8.53 v53.02,6.86
SCL  (via drill 0.3)
  Top 0.203: v58.97,14.48 59.58,13.87 59.88,13.87 RN2.7 | 70.25,14.17 69.33,13.26 Q4.3 | 70.25,14.17 70.7,14.63 70.7,15.54 69.48,16.76 v61.26,16.76 58.51,16.76 57.9,17.37 57.9,17.68 57.29,18.29 56.07,18.29 v53.79,18.9 | v47.39,17.22 47.39,16 MCU.28 | 70.25,14.17 v70.7,14.17
  Bottom 0.203: v61.26,16.76 v58.97,14.48 | v47.39,17.22 49.37,17.22 51.04,18.9 v53.79,18.9 | JP6.4 83.05,3.81 72.68,14.17 v70.7,14.17
SCL_3V3  (via drill 0.3)
  Top 0.203: v64.15,14.63 61.26,14.63 RN2.3 | v67.66,15.54 68.27,15.54 68.57,15.24 Q4.2 | v66.74,17.53 66.74,25.3 67.96,26.52 68.57,26.52 RTC.16
  Bottom 0.203: v64.15,14.63 66.74,14.63 v67.66,15.54 66.74,16.46 v66.74,17.53
SD_CLK
  Top 0.203: LSHIFT.2 30.77,29.41 30.16,29.41 28.64,27.89 28.64,27.43 26.96,25.76 26.35,25.76 SD.5
SD_CS  (via drill 0.3)
  Top 0.203: v29.1,19.96 29.1,23.16 30.32,24.38 30.77,24.38 LSHIFT.6 | v27.42,16.92 26.2,15.7 SD.1
  Bottom 0.203: v29.1,19.96 29.1,18.59 v27.42,16.92
SD_DI  (via drill 0.3)
  Top 0.203: v32.3,21.03 32.3,26.21 31.54,26.98 30.93,26.98 LSHIFT.4 | v30.47,19.2 27.27,19.2 26.35,18.29 SD.2
  Bottom 0.203: v30.47,19.2 v32.3,21.03
SDA  (via drill 0.3)
  Top 0.203: 58.51,10.97 58.51,10.82 58.97,10.36 63.08,10.36 65.67,12.95 Q3.3 | 58.51,10.97 58.51,11.43 59.43,12.34 59.43,12.5 59.88,12.95 RN2.8 | v48.61,14.63 47.23,14.63 46.62,15.24 46.62,15.85 MCU.27 | v51.5,15.85 52.42,15.85 53.79,14.48 v54.4,14.48 | 58.51,10.97 v58.21,10.67 | JP6.3 78.78,3.81 73.45,9.14 v60.04,9.14
  Bottom 0.203: v48.61,14.63 49.83,15.85 v51.5,15.85 | v54.4,14.48 v58.21,10.67 58.51,10.67 v60.04,9.14
SDA_3V3
  Top 0.203: RN2.4 61.26,15.39 64.61,15.39 65.06,14.94 Q3.2 65.22,14.78 67.5,12.5 70.09,12.5 71.47,13.87 71.47,16.15 71.5,17.03 71.5,21.59 69.94,23.47 67.35,23.47 67.2,23.62 67.2,24.54 67.96,25.3 68.57,25.3 RTC.15
TX-O  (via drill 0.3)
  Top 0.203: RN1.7 86.86,3.66 85.49,3.66 84.27,2.44 78.17,2.44 76.8,3.81 JP6.2 76.65,3.81 72.07,8.38 59.73,8.38 58.66,8.53 v53.02,8.53 | v50.43,14.63 49.83,15.24 49.83,15.85 MCU.31
  Bottom 0.203: v50.43,14.63 50.43,12.04 52.42,9.91 v53.02,8.53
VCC  (via drill 0.3)
  Top 0.203: 52.72,19.81 52.11,19.81 MCU.4 | 52.72,19.81 53.02,20.12 53.02,21.03 52.72,21.34 52.11,21.34 MCU.6 | 55.92,14.78 55.31,14.33 55.31,13.26 53.94,11.89 53.18,11.89 CLOCK.1 | 55.92,14.78 56.38,15.24 56.38,15.7 R_RESET.2 | 52.72,19.81 53.02,19.51 53.02,17.68 v55.31,15.39 55.92,14.78 | 43.42,11.89 42.97,11.89 L_LPF.1 | 43.42,11.89 44.03,11.89 44.95,12.8 46.17,12.8 46.78,13.41 46.78,13.72 C14.B1 | L_LPF.1 42.81,11.73 42.21,8.84 40.53,8.84 SENSE.1 39.92,11.58 39.46,11.58 39,12.04 35.04,12.04 LD0_SD.1 | RN2.2 61.26,13.72 61.26,13.11 RN2.1 61.26,12.95 v61.26,11.12 | v69.18,9.91 73.14,13.87 RCKL1.2 73.29,14.02 73.29,28.96 73.75,29.41 73.75,43.59 | v43.27,9.75 43.42,11.89 | v44.34,8.23 50.89,8.23 52.42,7.77 62.17,7.77 66.13,3.81 H1.7 | 43.42,11.89 L_LPF.1 | ISP.2 19.8,42.37 20.72,42.37 21.78,43.43 44.49,43.43 47.23,40.69 H3.5 47.39,40.69 48.3,40.69 51.2,43.59 73.75,43.59 | COUT.1 95.7,32 97.37,33.68 97.37,36.27 96.61,37.03 DECOUP.1 96.46,37.19 92.95,40.69 | 92.95,40.69 92.65,40.69 | 92.65,40.69 91.89,40.69 RSTAT.2 | 92.95,40.69 92.95,35.81 92.5,35.51 92.04,35.51 IC1.6 91.89,35.36 91.12,35.36 86.86,31.09 86.86,25.6 | 86.86,25.6 87.16,25.6 J1.PWR 86.86,25.6 | 86.86,25.6 85.79,25.6 83.96,27.43 83.96,30.48 Q1.2 83.96,30.63 83.05,31.55 81.52,31.55 80.61,30.63 Q2.2 | 73.75,43.59 92.19,43.59 92.65,43.13 92.65,40.69
  Bottom 0.203: 61.26,9.45 61.26,8.69 64.61,5.33 | 61.26,9.45 v61.26,11.12 | 64.61,5.33 66.13,3.81 H1.7 | 64.61,5.33 v69.18,9.91 | v44.34,8.23 v43.27,9.75 | 61.26,9.45 v55.31,15.39
VCL  (via drill 0.3)
  Top 0.203: CLOCK.5 50.59,11.73 51.5,11.73 52.11,11.12 53.79,11.12 56.07,13.41 C_LDO_SENSE1.2 56.23,13.56 v57.45,14.78 | v61.1,18.29 61.1,24.23 60.04,25.3 59.43,25.3 RTC.2
  Bottom 0.203: v57.45,14.78 v61.1,18.29
VDD  (via drill 0.3)
  Top 0.203: Q4.1 69.79,15.09 69.03,14.33 68.11,14.33 67.66,14.78 66.44,14.78 Q3.1 66.28,14.94 65.22,16 60.49,16 60.04,15.54 RN2.5 | RN2.6 60.04,14.63 60.04,15.39 RN2.5 | C14.A1 47.69,13.72 47.69,13.11 v49.06,11.73 49.67,11.12 50.89,10.97 51.5,10.97 52.87,10.21 56.07,10.21 58.21,12.34 58.21,14.78 58.82,15.39 59.88,15.39 RN2.5 | 22.7,24.99 22.7,28.96 23,29.26 27.88,29.11 29.56,30.79 30.77,30.79 LSHIFT.1 | 22.7,24.99 25.59,23.16 26.2,23.16 SD.4 | 22.7,24.99 22.7,16 24.22,14.63 27.88,14.63 29.25,13.26 30.01,13.26 C_LDO_SD.2 30.16,13.11 31.38,13.11 32.3,12.19 LD0_SD.5 32.45,12.19 v33.98,10.52 | v46.32,7.47 43.12,7.47 40.22,5.03 39.61,5.03 v35.5,9.14
  Bottom 0.203: v49.06,11.73 49.06,10.82 v46.32,7.47 | v33.98,10.52 v35.5,9.14
VUSB
  Top 0.203: RN1.6 87.01,4.57 87.01,5.18 RN1.5 86.86,5.33 86.86,10.52 86.4,10.97 86.4,12.8 87.47,13.87 JP5.VBUS 87.47,14.02 86.25,15.85 84.72,15.85 U1.20 84.57,16 81.07,16 78.02,19.05 77.41,19.05 U1.4 77.26,19.05 74.82,19.05 C17.1 74.67,19.05 74.67,26.06 76.95,28.35 | 76.95,28.35 81.37,28.35 Q2.3 | 76.95,28.35 75.28,30.02 C21.A
X0  (via drill 0.3)
  Top 0.203: 55.01,19.51 56.38,19.51 CX0.2 | 55.01,19.51 52.72,22.1 52.11,22.1 MCU.7 | 55.01,19.51 v55.01,22.4
  Bottom 0.203: v55.01,22.4 XTAL.2
X1
  Top 0.203: CX1.2 55.62,24.23 53.64,23.01 52.11,22.86 MCU.8 51.96,23.01 51.5,23.47 51.5,24.99 50.43,26.06 50.43,29.41 XTAL.1

### Text on the board
tPlace: MISO | MOSI | SCK | D7 | VCC | GND | 3V3 | GND | 1 | TM | TM | TM | v. 2.0.0 / 17 May 2016 / Andy Wickert / Chad Sandell / University of Minnesota | A0 | 3V3 | A1 | 3V3 | A2 | 3V3 | A3 | 3V3 | A6 | 3V3 | A7 | 3V3 | D3- / INT1 | GND | VCC | GND | RX | TX | SDA | SCL | Tx | Rx